# EAGLE design rgblcdshield (EAGLE 5.01)
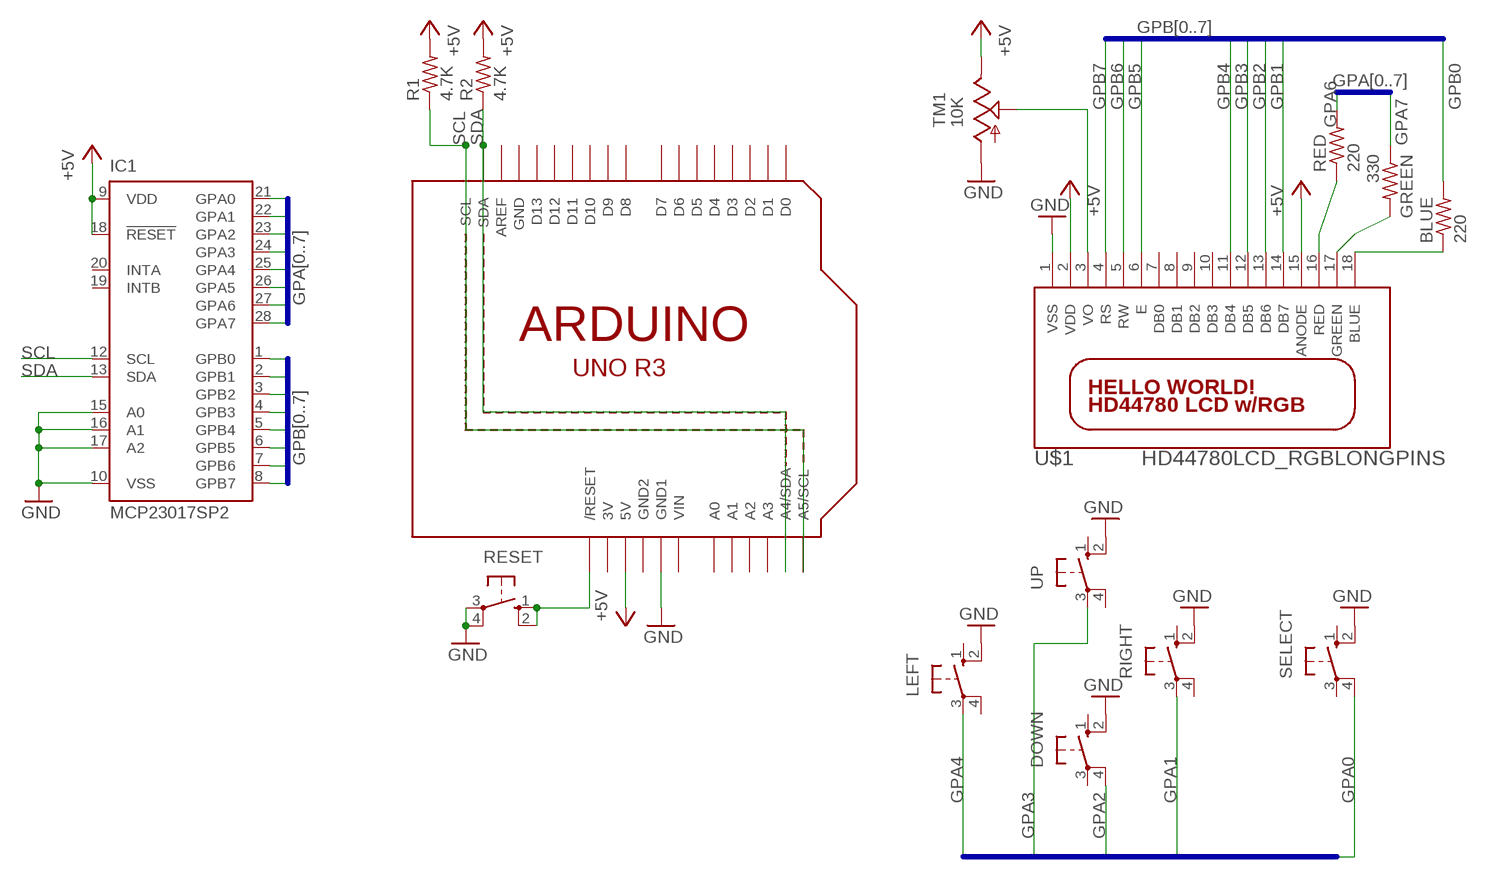
[diagram p0: schematic, sheet 1]

## Parts
BLUE  220  R-US_0207/10  [0207/10]
DOWN  10-XX  [B3F-10XX]
GREEN  330  R-US_0207/10  [0207/10]
IC1  MCP23017SP2  [DIL28-3-ROUND]
LEFT  10-XX  [B3F-10XX]
R1  4.7K  R-US_0207/10  [0207/10]
R2  4.7K  R-US_0207/10  [0207/10]
RED  220  R-US_0207/10  [0207/10]
RESET  10-XX  [B3F-10XX]
RIGHT  10-XX  [B3F-10XX]
SELECT  10-XX  [B3F-10XX]
TM1  10K  TRIM  [6MM]
U1  ARDUINOR3-NOIOREF-NOTEXT  [ARDUINOR3-NOTEXT-NOIOREF]
U$1  HD44780LCD_RGBLONGPINS  [LCD1602-RGB]
UP  10-XX  [B3F-10XX]

## Nets
+5V: IC1.9(VDD) IC1.18(!RESET) R1.2 R2.2 TM1.E U1.5V U$1.2(VDD) U$1.15(ANODE)
GND: DOWN.2(S1) IC1.10(VSS) IC1.15(A0) IC1.16(A1) IC1.17(A2) LEFT.2(S1) RESET.3(P) RESET.4(P1) RIGHT.2(S1) SELECT.2(S1) TM1.A U1.GND1 U$1.1(VSS) UP.2(S1)
GPA0: IC1.21(GPA0) SELECT.4(P1)
GPA1: IC1.22(GPA1) RIGHT.3(P)
GPA2: DOWN.4(P1) IC1.23(GPA2)
GPA3: IC1.24(GPA3) UP.3(P)
GPA4: IC1.25(GPA4) LEFT.3(P)
GPA5: IC1.26(GPA5)
GPA6: IC1.27(GPA6) RED.2
GPA7: GREEN.1 IC1.28(GPA7)
GPB0: BLUE.2 IC1.1(GPB0)
GPB1: IC1.2(GPB1) U$1.14(DB7)
GPB2: IC1.3(GPB2) U$1.13(DB6)
GPB3: IC1.4(GPB3) U$1.12(DB5)
GPB4: IC1.5(GPB4) U$1.11(DB4)
GPB5: IC1.6(GPB5) U$1.6(E)
GPB6: IC1.7(GPB6) U$1.5(RW)
GPB7: IC1.8(GPB7) U$1.4(RS)
N$2: BLUE.1 U$1.18(BLUE)
N$3: GREEN.2 U$1.17(GREEN)
N$4: RED.1 U$1.16(RED)
N$5: TM1.S U$1.3(VO)
N$6: RESET.1(S) RESET.2(S1) U1.RESET(/RESET)
SCL: IC1.12(SCL) R1.1 U1.A5(A5/SCL) U1.SCL
SDA: IC1.13(SDA) R2.1 U1.A4(A4/SDA) U1.SDA
Unconnected: DOWN.1(S) DOWN.3(P) IC1.19(INTB) IC1.20(INTA) LEFT.1(S) LEFT.4(P1) RIGHT.1(S) RIGHT.4(P1) SELECT.1(S) SELECT.3(P) U1.A0 U1.A1 U1.A2 U1.A3 U1.AREF U1.D0 U1.D1 U1.D2 U1.D3 U1.D4 U1.D5 U1.D6 U1.D7 U1.D8 U1.D9 U1.D10 U1.D11 U1.D12 U1.D13 U$1.7(DB0) U$1.8(DB1) U$1.9(DB2) U$1.10(DB3) UP.1(S) UP.4(P1)

## Buses
GPB[0..7]
GPA[0..7]

## Power pins joined to a net without a drawn wire
3V: U1.3V
GND: U1.GND
GND2: U1.GND2
VIN: U1.VIN

## Library data of the parts
BLUE GREEN R1 R2 RED = adafruit:R-US_: RESISTOR, American symbol
DOWN LEFT RESET RIGHT SELECT UP = switch-omron:10-XX: OMRON SWITCH
IC1 = adafruit:MCP23017: http://ww1.microchip.com/downloads/en/DeviceDoc/21952a.pdf Source: http://ww1.microchip.com/downloads/en/DeviceDoc/21952a.pdf
TM1 = adafruit:TRIM
U1 = adafruit:ARDUINOR3-NOIOREF
U$1 = adafruit:HD44780LCD_RGB

## Board
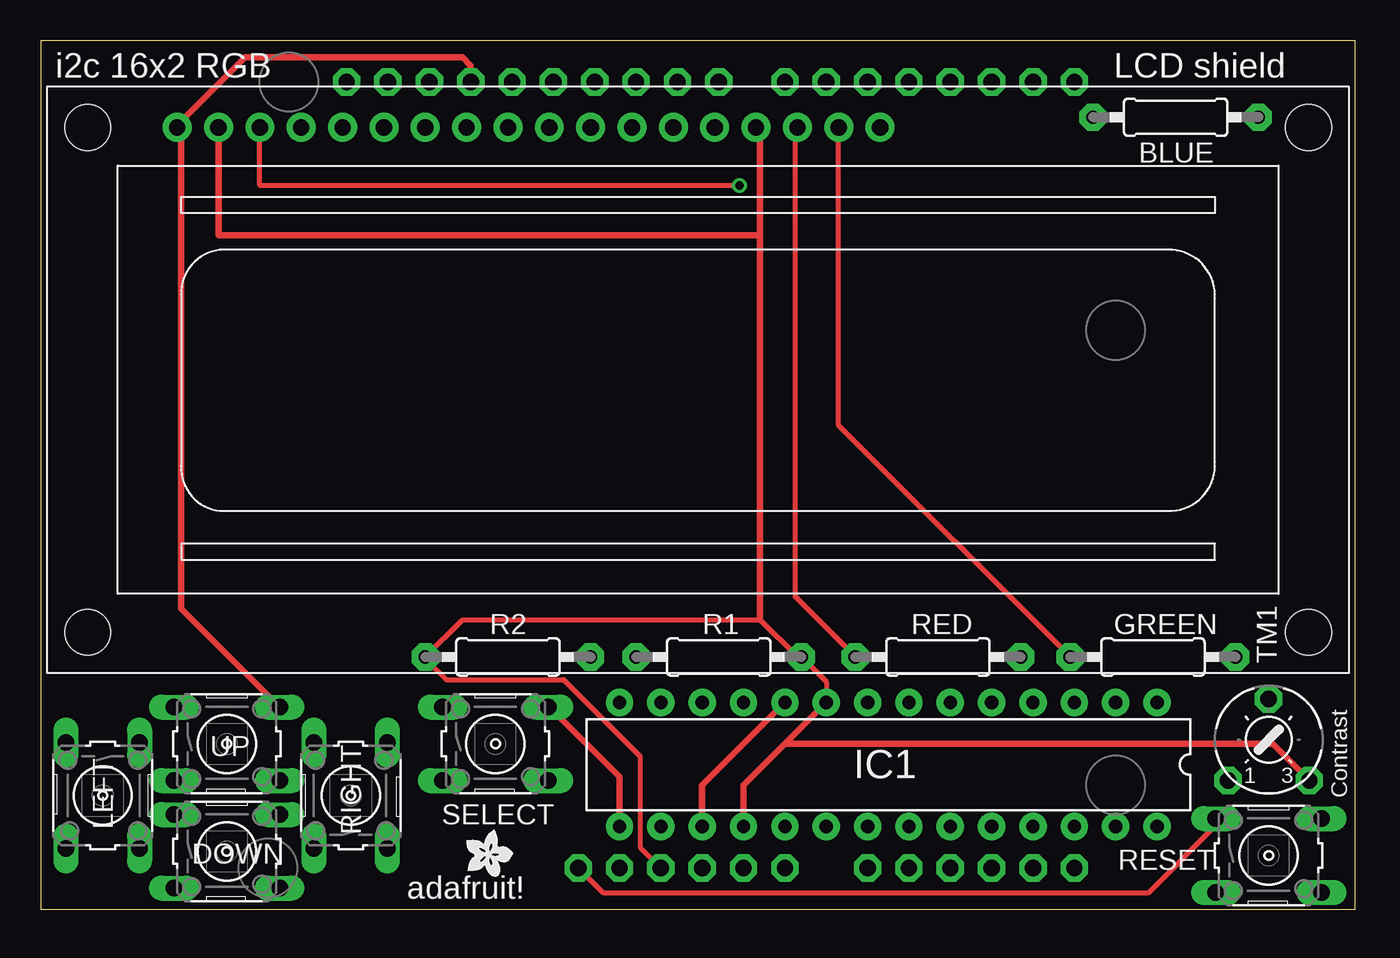
[diagram p1: board, top side]
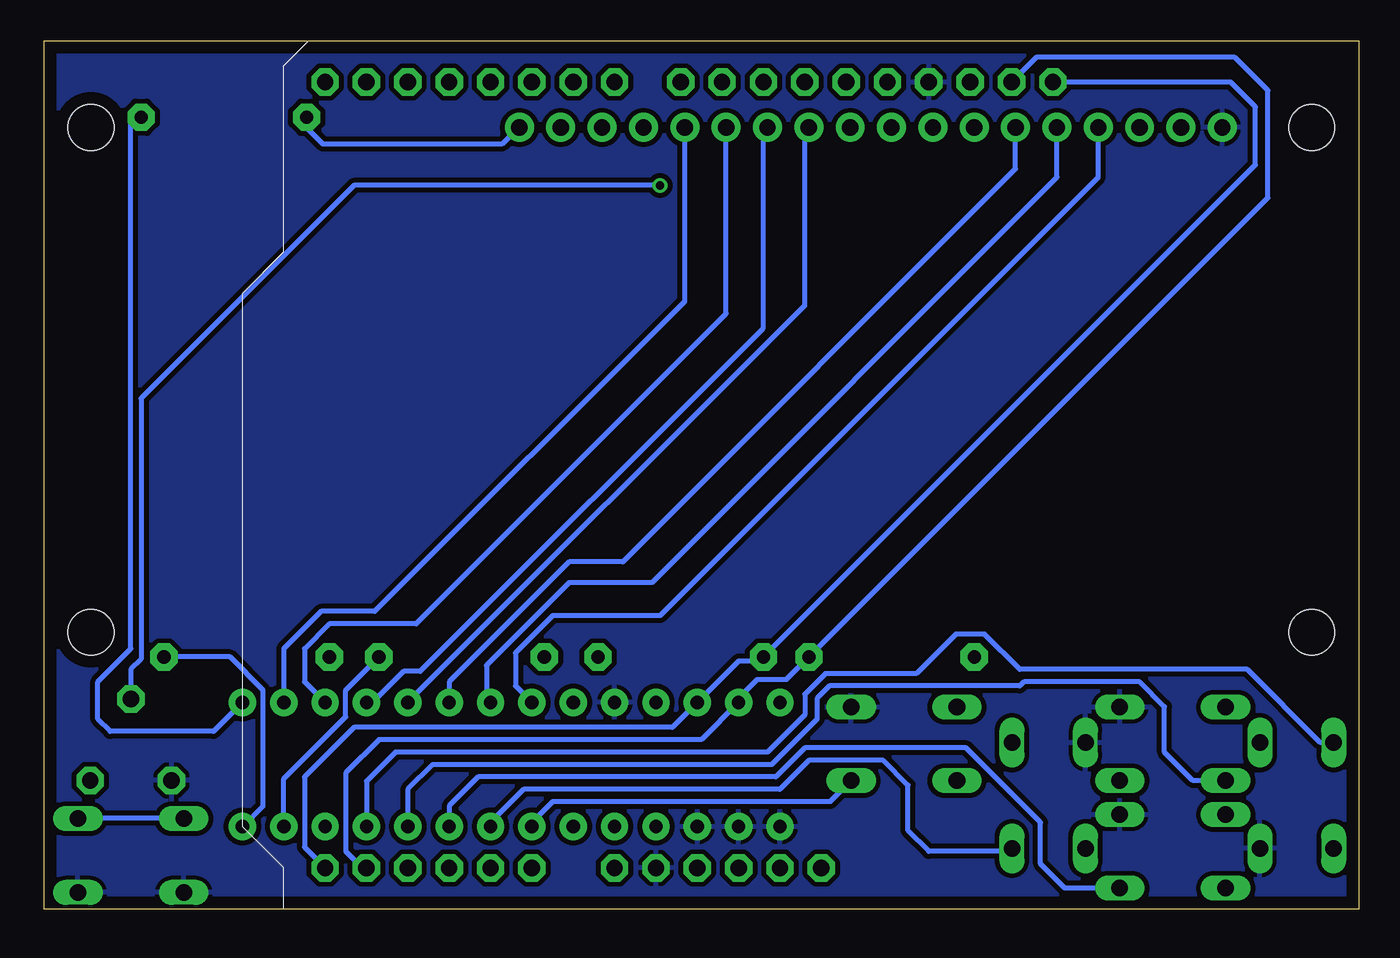
[diagram p2: board, bottom side, seen from below]

Size 80.77 x 53.34 mm. Coordinates in mm from the lower left corner, seen from the top.
Outline: 0,0 80.77,0 80.77,53.34 0,53.34 0,0
Copper layers (1*16): Top 0.035mm / dielectric 1.5mm / Bottom 0.035mm
Design rules "default *": minimum track width 12mil, minimum drill 19mil, track to track 12mil, track to pad 12mil, pad to pad 12mil, via to via 12mil, smd to smd 8mil, copper to edge 30mil, drill to drill 8mil, minimum pad ring 10mil, minimum via ring 8mil, stop-mask expansion 4mil, vias tented up to drill 0mil, thermal gap 10mil

### Footprints (pad centres in the part's own frame; a part is rotated, then mirrored left to right if it is on the bottom)
0207/10 = drill 0.813 pad 1.676 octagon: 1 -5.08,0; 2 5.08,0
B3F-10XX = drill 1.016 long: 1 -3.251,2.261; 2 3.251,2.261; 3 -3.251,-2.261; 4 3.251,-2.261
DIL28-3-ROUND = drill 0.813 pad 1.676 round: 1 -16.51,-3.81; 2 -13.97,-3.81; 3 -11.43,-3.81; 4 -8.89,-3.81; 5 -6.35,-3.81; 6 -3.81,-3.81; 7 -1.27,-3.81; 8 1.27,-3.81; 9 3.81,-3.81; 10 6.35,-3.81; 11 8.89,-3.81; 12 11.43,-3.81; 13 13.97,-3.81; 14 16.51,-3.81; 15 16.51,3.81; 16 13.97,3.81; 17 11.43,3.81; 18 8.89,3.81; 19 6.35,3.81; 20 3.81,3.81; 21 1.27,3.81; 22 -1.27,3.81; 23 -3.81,3.81; 24 -6.35,3.81; 25 -8.89,3.81; 26 -11.43,3.81; 27 -13.97,3.81; 28 -16.51,3.81
6MM = drill 1 pad 1.676 octagon: A -2.5,-2.5; E 2.5,-2.5; S 0,2.5
ARDUINOR3-NOTEXT-NOIOREF = drill 1 pad 1.676 octagon: 3V 35.56,2.54; 5V 38.1,2.54; A0 50.8,2.54; A1 53.34,2.54; A2 55.88,2.54; A3 58.42,2.54; A4 60.96,2.54; A5 63.5,2.54; AREF 23.876,50.8; D0 63.5,50.8; D1 60.96,50.8; D2 58.42,50.8; D3 55.88,50.8; D4 53.34,50.8; D5 50.8,50.8; D6 48.26,50.8; D7 45.72,50.8; D8 41.656,50.8; D9 39.116,50.8; D10 36.576,50.8; D11 34.036,50.8; D12 31.496,50.8; D13 28.956,50.8; GND 26.416,50.8; GND1 43.18,2.54; GND2 40.64,2.54; RESET 33.02,2.54; SCL 18.796,50.8; SDA 21.336,50.8; VIN 45.72,2.54
LCD1602-RGB = drill 1 pad 1.778 round: 1 -32,15.5; 2 -29.46,15.5; 3 -26.92,15.5; 4 -24.38,15.5; 5 -21.84,15.5; 6 -19.3,15.5; 7 -16.76,15.5; 8 -14.22,15.5; 9 -11.68,15.5; 10 -9.14,15.5; 11 -6.6,15.5; 12 -4.06,15.5; 13 -1.52,15.5; 14 1.02,15.5; 15 3.56,15.5; 16 6.1,15.5; 17 8.64,15.5; 18 11.18,15.5 | hole 2.8: -37.5,-15.5; -37.5,15.5; 37.5,15.5; 37.5,-15.5

### Placement (x,y rotation side)
BLUE  69.72,48.64 0 top
DOWN  11.43,3.56 0 top
GREEN  68.33,15.49 180 top
IC1  52.07,8.89 180 top
LEFT  3.81,6.99 270 top
R1  41.66,15.49 0 top
R2  28.7,15.49 180 top
RED  55.12,15.49 0 top
RESET  75.44,3.3 0 top
RIGHT  19.05,6.99 90 top
SELECT  27.94,10.16 0 top
TM1  75.44,10.41 0 top
U1  0,0 0 top
U$1  40.39,32.51 0 top
U$2  [ADAFRUIT200MIL]  27.56,3.56 270 top
UP  11.43,10.16 0 top

### Tracks (layer width: path | path; a pad name or v marks a point on that pad's centre or on a via)
+5V
  Top 0.305: IC1.9 48.26,13.97 R1.2 46.48,15.49 44.2,17.78 25.91,17.78 R2.2 23.62,15.37 24.89,14.1 32.13,14.1 36.83,9.4 36.83,3.81 U1.5V | U$1.15 44.2,47.76 44.2,47.24
  Top 0.406: 44.14,47.24 44.2,47.24 44.2,41.4 | 44.2,17.78 44.2,41.4 | IC1.9 45.72,10.16 | TM1.E 75.69,10.16 45.72,10.16 | 42.93,5.08 IC1.18 43.18,7.62 45.72,10.16 | 44.2,41.4 10.92,41.4 U$1.2
GND
  Top 0.406: U1.GND 26.42,51.82 25.91,52.32 12.57,52.32 8.38,48.13 8.39,48.13 U$1.1 8.64,47.75 8.64,18.47 UP.2 | IC1.10 40.64,7.62 IC1.17 | SELECT.2 31.22,12.42 31.24,12.45 35.56,8.13 IC1.15
  pour Bottom: 0,53.34 0,0 81.03,0 81.03,53.34
GPA0
  Bottom 0.305: IC1.21 50.8,5.33 49.53,6.6 32.49,6.6 SELECT.4
GPA1
  Bottom 0.305: RIGHT.3 21.49,3.56 26.42,3.56 27.69,4.83 27.69,7.62 29.21,9.14 33.78,9.14 35.56,7.37 51.31,7.37 53.34,5.33 IC1.22
GPA2
  Bottom 0.305: DOWN.4 18.06,1.29 19.56,2.79 19.56,5.33 24.13,9.91 34.04,9.91 35.81,8.13 54.1,8.13 55.88,6.35 55.88,5.33 55.63,5.08 IC1.23
GPA3
  Bottom 0.305: UP.3 10.19,7.9 11.94,9.65 11.94,12.45 13.46,13.97 20.57,13.97 20.83,13.72 32.51,13.72 33.27,12.95 33.27,11.68 36.07,8.89 56.9,8.89 58.42,7.37 IC1.24
GPA4
  Bottom 0.305: LEFT.3 2.36,10.24 6.86,14.73 20.83,14.73 22.99,16.89 24.77,16.89 27.18,14.48 32.77,14.48 34.04,13.21 34.04,11.94 36.32,9.65 59.18,9.65 60.96,7.87 IC1.25
GPA6
  Bottom 0.305: RED.2 62.23,13.46 62.23,11.81 66.04,8 IC1.27
GPA7
  Bottom 0.305: IC1.28 67.31,6.35 67.31,13.46 69.34,15.49 GREEN.1
GPB0
  Bottom 0.305: BLUE.2 75.31,48.64 75.44,48.64 75.44,16 77.47,13.97 77.47,11.68 76.71,10.92 70.36,10.92 IC1.1
GPB1
  Bottom 0.305: 65.53,12.7 IC1.2 66.04,16 63.75,18.29 60.45,18.29 41.4,37.34 41.4,47.24 41.46,47.24 41.46,47.95 U$1.14
GPB2
  Bottom 0.305: IC1.3 64.77,13.97 64.77,16 63.25,17.53 57.91,17.53 38.86,36.58 U$1.13
GPB3
  Bottom 0.305: IC1.4 60.58,12.7 58.67,14.61 57.66,14.61 36.58,35.69 36.58,47.75 U$1.12
GPB4
  Bottom 0.305: IC1.5 34.04,37.08 34.04,47.24 33.98,47.24 33.98,47.81 U$1.11
GPB5
  Bottom 0.305: 21.08,47.3 21.08,45.47 45.21,21.34 48.51,21.34 55.88,13.97 IC1.6 | 21.08,47.3 21.08,47.5 | U$1.6 21.08,47.3
GPB6
  Bottom 0.305: IC1.7 53.59,12.95 53.59,14.99 48.51,20.07 43.43,20.07 18.54,44.96 18.54,47.24 18.6,47.24 18.54,47.3 U$1.5
GPB7
  Bottom 0.305: IC1.8 51.82,13.72 51.82,15.75 49.53,18.03 42.93,18.03 16,44.96 U$1.4
N$2
  Bottom 0.305: BLUE.1 64.64,48.01 63.63,46.99 52.64,46.99 51.62,48.01 U$1.18
N$3
  Top 0.305: U$1.17 49.02,29.72 GREEN.2
N$4
  Top 0.305: RED.1 46.35,19.18 46.35,47.88 U$1.16
N$5  (via drill 0.5)
  Top 0.305: v42.93,44.45 13.46,44.45 U$1.3
  Bottom 0.305: v42.93,44.45 61.72,44.45 74.8,31.37 74.8,15.37 75.44,14.73 TM1.S
N$6
  Top 0.305: U1.RESET 34.54,1.02 68.07,1.02 72.39,5.33 72.39,5.59 72.21,5.59 RESET.1
  Bottom 0.305: 72.16,5.59 72.14,5.59 | RESET.1 72.16,5.59 | RESET.2 78.66,5.59 72.16,5.59
SCL
  Bottom 0.305: U1.A5 64.77,3.81 64.77,8.13 61.72,11.18 42.16,11.18 IC1.12 38.1,15.24 36.83,15.24 R1.1 6.35,45.72 6.35,49.28 7.87,50.8 U1.SCL
SDA
  Bottom 0.305: U1.SDA 19.81,52.32 7.62,52.32 5.59,50.29 5.59,43.69 R2.1 | R2.1 33.27,16 | U1.A4 61.21,2.54 62.23,3.56 62.23,8.38 60.2,10.41 40.39,10.41 IC1.13 38.1,12.95 36.96,14.1 35.18,14.1 R2.1

### Text on the board
tPlace: i2c 16x2 RGB | LCD shield | Contrast | adafruit!